# Altium schematic sheet RTDIface.SchDoc
size A; SheetNumber: 7; SheetTotal: 10
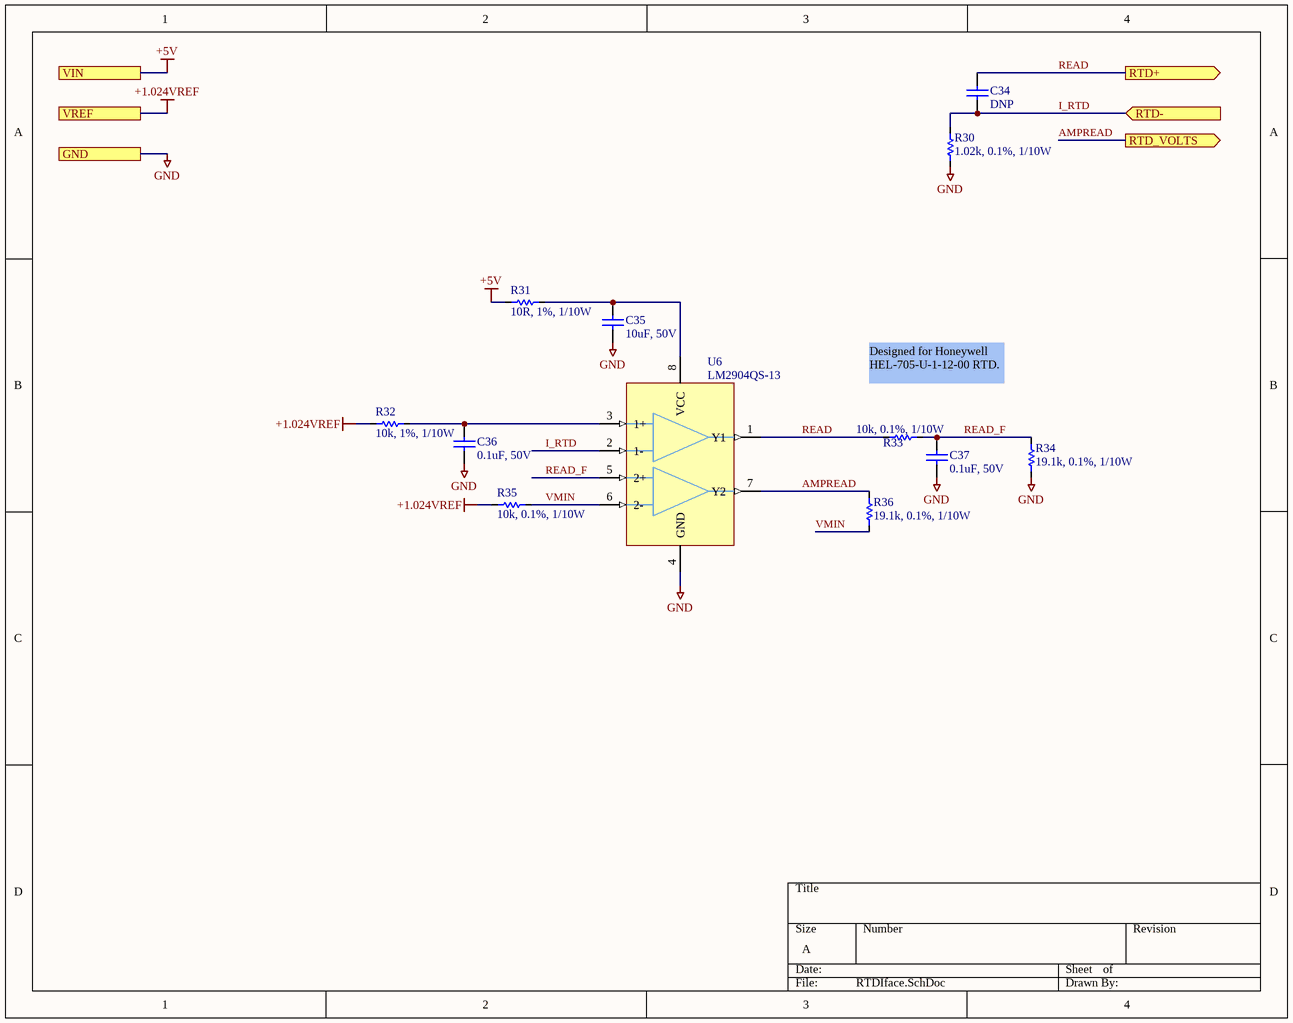
[diagram p0: RTDIface.SchDoc]

## Parts
C34  DNP  [0603]
C35  10uF, 50V  [1206]
C36  0.1uF, 50V  [0805]
C37  0.1uF, 50V  [0805]
R30  1.02k, 0.1%, 1/10W  [0603]
R31  10R, 1%, 1/10W  [0603]
R32  10k, 1%, 1/10W  [0603]
R33  10k, 0.1%, 1/10W  [0603]
R34  19.1k, 0.1%, 1/10W  [0603]
R35  10k, 0.1%, 1/10W  [0603]
R36  19.1k, 0.1%, 1/10W  [0603]
U6  LM2904QS-13  [SOIC127P600X163-8N]

## Ports
GND, RTD+ (out), RTD- (in), RTD_VOLTS (out), VIN, VREF

## Nets
+1.024VREF: R32.2 R35.1 ; port VREF
+5V: R31.1 ; port VIN
GND: C35.1 C36.1 C37.1 R30.1 R34.1 U6.4(GND) ; port GND
AMPREAD: R36.2 U6.7(Y2) ; port RTD_VOLTS
I_RTD: C34.2 R30.2 U6.2(1-) ; port RTD-
READ: C34.1 R33.1 U6.1(Y1) ; port RTD+
READ_F: C37.2 R33.2 R34.2 U6.5(2+)
VMIN: R35.2 R36.1 U6.6(2-)
NetC35_2: C35.2 R31.2 U6.8(VCC)
NetC36_2: C36.2 R32.1 U6.3(1+)

## Notes on the sheet
- Designed for Honeywell HEL-705-U-1-12-00 RTD.

## Library data of the parts
C34 = NS00848: CAP CER 10000PF 100V C0G 0603; Type: C; Value: 10nF, 100V; Alternatives: Generic; Part Number: NS00848; Supplier 1: Digi-Key; Supplier Part Number 1: 445-172665-1-ND
C35 = NS00832: CAP CER 10UF 50V X7R 1206; Type: C; Alternatives: Generic; Part Number: NS00832; Value: 10uF, 50V; Supplier 1: Digi-Key; Supplier Part Number 1: 1276-6767-1-ND
C36 C37 = NS00353: 0.10µF ±10% 50V Ceramic Capacitor X7R 0805 (2012 Metric); Type: C; Alternatives: Generic; Part Number: NS00353; Value: 0.1uF, 50V; Supplier 1: Digi-Key; Supplier Part Number 1: 478-1395-1-ND
R30 = NS00884: RES SMD 1.02KOHM 0.1% 1/10W 0603; Alternatives: Generic; Part Number: NS00884; Type: R; Value: 1.02k, 0.1%, 1/10W; Supplier 1: Digi-Key; Supplier Part Number 1: YAG2308CT-ND
R31 = NS00796: RES 10 OHM 1% 1/10W 0603; Alternatives: Generic; Part Number: NS00796; Type: R; Value: 10R, 1%, 1/10W; Supplier 1: Digi-Key; Supplier Part Number 1: 1292-WR06X10R0FTLCT-ND
R32 = NS00820: RES 10K OHM 1% 1/10W 0603; Alternatives: Generic; Part Number: NS00820; Type: R; Value: 10k, 1%, 1/10W; Supplier 1: Digi-Key; Supplier Part Number 1: RMCF0603FT10K0CT-ND
R33 R35 = NS00885: RES SMD 10K OHM 0.1% 1/10W 0603; Alternatives: Generic; Part Number: NS00885; Type: R; Value: 10k, 0.1%, 1/10W; Supplier 1: Digi-Key; Supplier Part Number 1: YAG1236CT-ND
R34 R36 = NS00886: RES SMD 19.1KOHM 0.1% 1/10W 0603; Alternatives: Generic; Part Number: NS00886; Type: R; Value: 19.1k, 0.1%, 1/10W; Supplier 1: Digi-Key; Supplier Part Number 1: YAG1555CT-ND
U6 = NS00864: IC OPAMP GP 2 CIRCUIT 8SO; Part Number: NS00864; Type: IC; Value: LM2904QS-13; ComponentLink1Description: Datasheet; ComponentLink1URL: H:\Doc\Diodes\LM2902Q-04Q.pdf; Supplier 1: Digi-Key; Supplier Part Number 1: LM2904QS-13DICT-ND